# Altium schematic sheet drivers.SchDoc
size A4; SheetNumber: 1; SheetTotal: 1
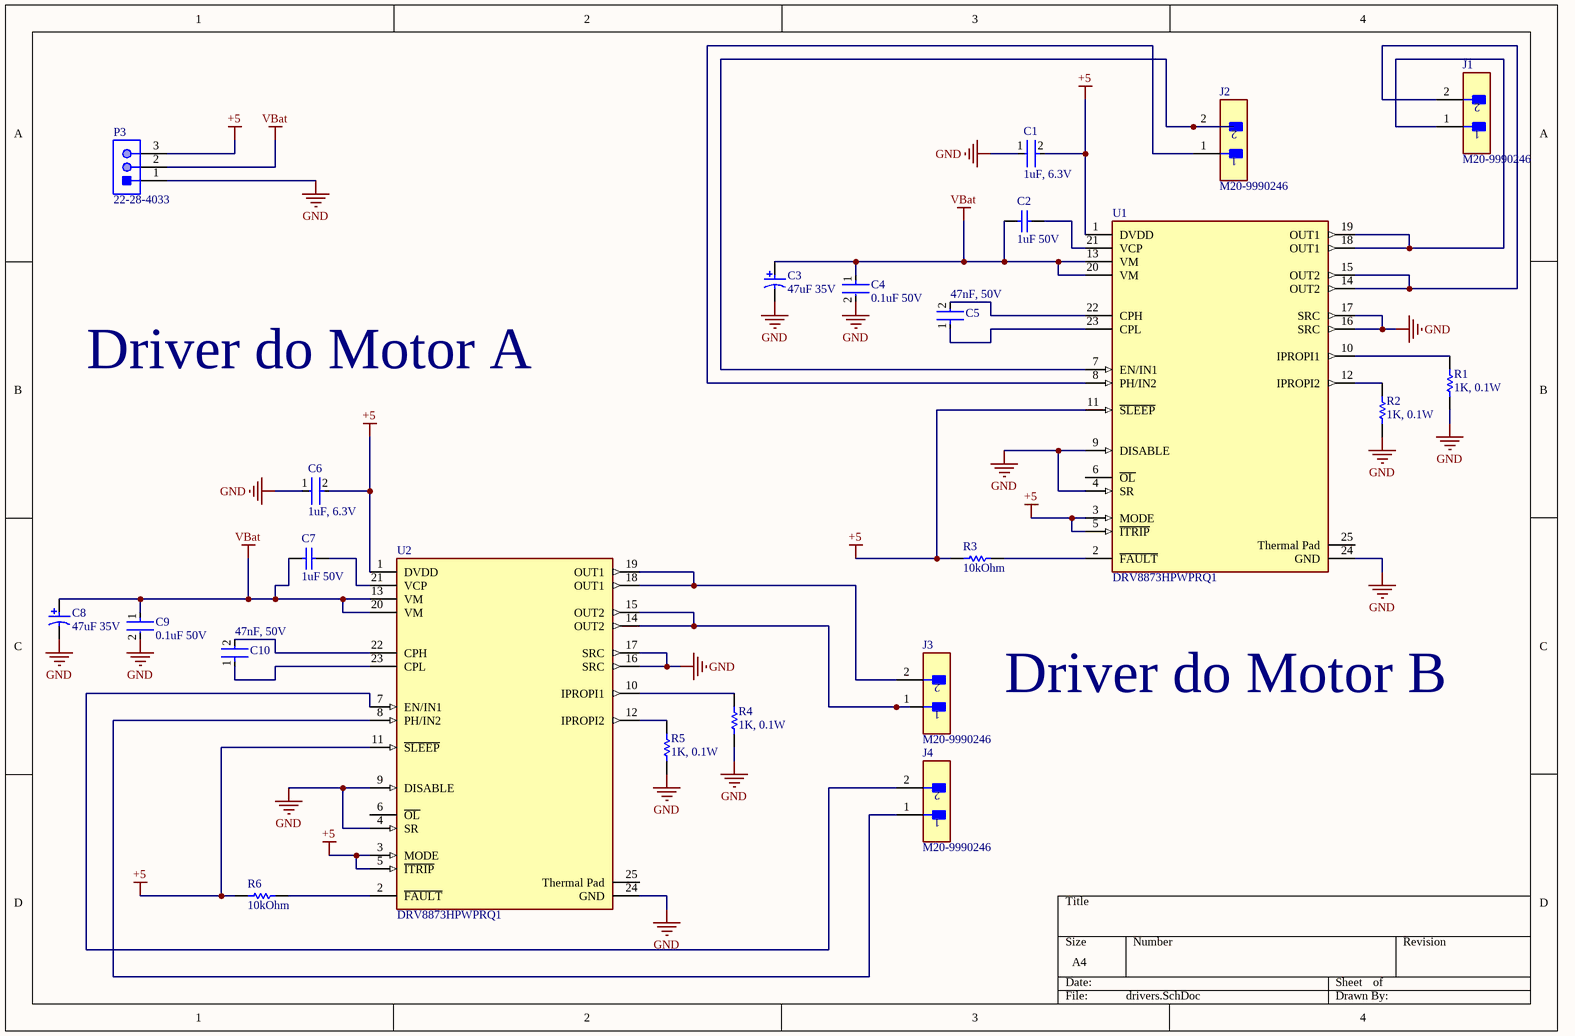
[diagram p0: drivers.SchDoc]

## Parts
C1  1uF, 6.3V  [FP-GRM188-0_1-MFG]
C2  1uF 50V  [CAPC1608X90X35ML10T25]
C3  47uF 35V  [PNSC-FP-V-D_V]
C4  0.1uF 50V  [FP-C0603-CJ-MFG]
C5  47nF, 50V  [FP-C0603C-CF-MFG]
C6  1uF, 6.3V  [FP-GRM188-0_1-MFG]
C7  1uF 50V  [CAPC1608X90X35ML10T25]
C8  47uF 35V  [PNSC-FP-V-D_V]
C9  0.1uF 50V  [FP-C0603-CJ-MFG]
C10  47nF, 50V  [FP-C0603C-CF-MFG]
J1  M20-9990246  [FP-M20-9990246-MFG]
J2  M20-9990246  [FP-M20-9990246-MFG]
J3  M20-9990246  [FP-M20-9990246-MFG]
J4  M20-9990246  [FP-M20-9990246-MFG]
P3  22-28-4033  [MOLX-22-28-4033_V]
R1  1K, 0.1W  [RESC1608X55X30LL20T20]
R2  1K, 0.1W  [RESC1608X55X30LL20T20]
R3  10kOhm  [RESC1609X55X30LL15T15]
R4  1K, 0.1W  [RESC1608X55X30LL20T20]
R5  1K, 0.1W  [RESC1608X55X30LL20T20]
R6  10kOhm  [RESC1609X55X30LL15T15]
U1  DRV8873HPWPRQ1  [FP-PWP0024J-MFG]
U2  DRV8873HPWPRQ1  [FP-PWP0024J-MFG]

## Nets
+5: C1.2 C6.2 P3.3 R3.1 R6.1 U1.1(DVDD) U1.3(MODE) U1.5(~{ITRIP}) U1.11(~{SLEEP}) U2.1(DVDD) U2.3(MODE) U2.5(~{ITRIP}) U2.11(~{SLEEP})
GND: C1.1 C3.2 C4.2 C6.1 C8.2 C9.2 P3.1 R1.1 R2.1 R4.1 R5.1 U1.4(SR) U1.9(DISABLE) U1.16(SRC) U1.17(SRC) U1.24(GND) U2.4(SR) U2.9(DISABLE) U2.16(SRC) U2.17(SRC) U2.24(GND)
VBat: C2.1 C3.1 C4.1 C7.1 C8.1 C9.1 P3.2 U1.13(VM) U1.20(VM) U2.13(VM) U2.20(VM)
NetC2_2: C2.2 U1.21(VCP)
NetC5_1: C5.1 U1.23(CPL)
NetC5_2: C5.2 U1.22(CPH)
NetC7_2: C7.2 U2.21(VCP)
NetC10_1: C10.1 U2.23(CPL)
NetC10_2: C10.2 U2.22(CPH)
NetJ1_1: J1.1 U1.18(OUT1) U1.19(OUT1)
NetJ1_2: J1.2 U1.14(OUT2) U1.15(OUT2)
NetJ2_1: J2.1 U1.8(PH/IN2)
NetJ2_2: J2.2 U1.7(EN/IN1)
NetJ3_1: J3.1 U2.14(OUT2) U2.15(OUT2)
NetJ3_2: J3.2 U2.18(OUT1) U2.19(OUT1)
NetJ4_1: J4.1 U2.8(PH/IN2)
NetJ4_2: J4.2 U2.7(EN/IN1)
NetR1_2: R1.2 U1.10(IPROPI1)
NetR2_2: R2.2 U1.12(IPROPI2)
NetR3_2: R3.2 U1.2(~{FAULT})
NetR4_2: R4.2 U2.10(IPROPI1)
NetR5_2: R5.2 U2.12(IPROPI2)
NetR6_2: R6.2 U2.2(~{FAULT})

Not connected (* = marked no-connect by the designer): U1 6(~{OL}) 25(Thermal_Pad); U2 6(~{OL}) 25(Thermal_Pad)

## Notes on the sheet
- Driver do Motor A
- Driver do Motor B

## Library data of the parts
C1 C6 = CMP-2006-02790-2: CAP CER 1UF 6.3V X5R 0603; Insulation Resistance: 500MR; Tolerance: 10%; Dielectric Material: Ceramic; Thickness: 0.035inch; Depth: 0.8mm; Min Operating Temperature: -55°C; Mount: Surface Mount; Voltage Rating (DC): 6.3V; Case/Package: 0603; Capacitance: 1uF; Voltage Rating: 6.3V; Voltage: 6.3V; Max Operating Temperature: 85°C; Case Code (Imperial): 0603; Dielectric: X5R; Packaging: Tape and Reel; Height: 0.8mm; Case Code (Metric): 1608; Radiation Hardening: No; REACH SVHC: No SVHC; Width: 0.031inch; Package Quantity: 1; Lead Free: Lead Free; Length: 1.6mm; Termination: SMD/SMT
C2 C7 = CMP-2000-05447-1: Chip Capacitor, 1 uF, +/- 10%, 50 V, -55 to 85 degC, 0603 (1608 Metric), RoHS, Tape and Reel; Manufacturer: Taiyo Yuden; Other Names: 587-2400-6; Temperature Coefficient: X5R; Online Catalog: MSeries; Catalog Drawings: xMKSeries_0603_0.8; Capacitance: 1µF; Series: M; Standard Package: 1; Package Description: 2-Pin Surface Mount Device, Body 1.6 x 0.8 mm; Ratings: -; Height - Seated (Max): -; Mounting Type: SurfaceMount,MLCC; Family: CeramicCapacitors; Size / Dimension: 0.063"Lx0.031"W(1.60mmx0.80mm); Features: -; Applications: GeneralPurpose; Lead Spacing: -; Packaging: Digi-Reel; Package Reference: 603; Thickness (Max): 0.035"(0.90mm); Category: Capacitors; Operating Temperature: -55degC~85degC; Datasheet URL: https://datasheet.ciiva.com/15922/336umk107bj105ka-t-15922611.pdf; Package / Case: 0603(1608Metric); Manufacturer URL: http://www.t-yuden.com/; Lead Style: -; Tolerance: ±10%; Voltage - Rated: 50V; Datasheet Version: Mar-13
C3 C8 = CMP-2000-06216-1: Aluminum Electrolytic Capacitor, 47 uF, +/- 20%, 35 V, 2-Pin SMD (Size Code D), -55 to 105 degC, RoHS, Tape and Reel; Manufacturer: Panasonic; Lifetime@Temperature: 2000Hrs@105°C; Capacitance: 47µF; Type: Can; Ripple Current: 300mA; ESR (Equivalent Series Resistance): 0.26O; Package Reference: FP-V-D; Package Description: 2-Pin Electrolytic Aluminum Capacitor, Body 6.6 x 6.6 mm; Datasheet URL: http://industrial.panasonic.com/cdbs/www-data/pdf/RDE0000/ABA0000C1184.pdf; Series: FP; Operating Temp Range: -55to+105°C; Operating Temp-Max: 105°C; Datasheet Version: 03/2016; Rated Voltage: 35V; Manufacturer URL: http://www.panasonic.com/; Package URL: http://industrial.panasonic.com/cdbs/www-data/pdf/RDE0000/DME0000COL48.pdf; Case Size/Dimension: Ø6.3x5.8mm; Mounting Technology: SurfaceMount
C4 C9 = CMP-2006-03300-2: CAP CER 0.1UF 50V X7R 0603; Manufacturer Part Number: C0603X104K5RACTU; Manufacturer: Kemet; Capacitance: 100nF; Material: Ceramic; Tolerance: 10%; Value: 100nF; Temperature Coefficient: 15%; Temperature Range High: +125°C; Temperature Range Low: -55°C; Voltage: 50V; ComponentLink2Description: Datasheet; RoHS: TRUE; ComponentLink2URL: https://content.kemet.com/datasheets/KEM_C1013_X7R_FT-CAP_SMD.pdf; Device Class L3: Ceramic Capacitors; Device Class L2: Capacitors; Package: C0603-CJ; Height: 0.95mm; Device Class L1: Passive Components; Temperature Characteristic: X7R; Lead Free: Yes; Digikey Description: CAP CER 0.1UF 50V X7R 0603; Automotive: No; Mouser Description: Capacitor; Ceramic; Cap 0.1uF; Tol+10%; SMT; Flexible Termination; Vol-Rtg 50V; TR; Temperature: -55°C to +125°C; Octopart: https://octopart.com/c0603x104k5ractu-kemet-9145062; Category: Cap; Voltage Rating: 50V; Ipc Land Pattern Name: CAPC16080X80
C5 C10 = CMP-2006-03232-2: CAP CER 0.047UF 50V 10% X7R 0603; Manufacturer: KEMET; Manufacturer Part Number: C0603C473K5RACTU; Value: 47,000 pF; Tolerance: 0.1; Temperature Coefficient: 30ppm/°C; Material: Ceramic; Automotive Grade: Grade 1; Lead Free: Yes; ComponentLink2URL: https://api.kemet.com/component-edge/download/datasheet/C0603C100J5GACAUTO.pdf; Temperature Characteristic: X7R; Category: Cap; Temperature Range High: +125°C; Automotive: Yes; Device Class L3: Ceramic Capacitors; Height: 0.87mm; Temperature: -55°C to +125°C; Mouser Description: Multilayer Ceramic Capacitors MLCC - SMD/SMT 50volts 47000pF X7R 10%; Package: C0603C-CF; Device Class L1: Passive Components; Digikey Description: CAP CER 0.047UF 50V 10% X7R 0603; Device Class L2: Capacitors; Voltage Rating: 50 V; Capacitance: 47,000 pF; ComponentLink2Description: Datasheet; RoHS: TRUE; Octopart: https://octopart.com/c0603c473k5ractu-kemet-9138594; Temperature Range Low: -55°C
J1-J4 = CMP-15831-000009-1: CONN HEADER VERT 2POS 2.54MM; Manufacturer: Harwin; Conn Gender: Male; Conn Orientation: Vertical; Number Of Contacts: 2; Current Rating: 3A; ComponentLink2URL: https://cdn.harwin.com/pdfs/M20-999.pdf; ComponentLink2Description: Datasheet; Package: M20-9990246; Temperature: -40°C to +105°C; Octopart: https://octopart.com/m20-9990246-harwin-2590635; Mouser Description: 2.54mm (0.1") Pitch SIL Vertical PC Tail Pin Header, 6.1mm mating pin height, tin, 2 contacts; Temperature Range High: +105°C; Device Class L1: Connectors; RoHS: TRUE; Automotive: No; Height: 8.99mm; Number Of Rows: 1; Contact Material: Tin,Nickel; Category: Conn; Pitch: 2.54mm; Lead Free: Yes; Digikey Description: CONN HEADER VERT 2POS 2.54MM; Manufacturer Part Number: M20-9990246; Temperature Range Low: -40°C; Device Class L3: unset; Device Class L2: Headers and Wire Housings
P3 = CMP-1676-00001-5: Male Header, Pitch 2.54 mm, 1 x 3 Position, Height 8.38 mm, Tail Length 3.18 mm, RoHS, Bulk; Manufacturer: Molex; Rows: 1; Voltage Rating: 250 V; Current Rating: 4 A; Min Operating Temperature: 0 degC; Lead Pitch: 0.1 inch; Packaging: Bulk; Contact Finish: Gold; RoHSCompliant: true; Contact Material: Brass; PackageReference: 22-28-4033; REACH SVHC: Unknown; PackageDescription: Male Header, Pitch 2.54 mm, 1 x 3 Position, Height 8.38 mm, Tail Length 3.18 mm; ComponentLink2URL: http://www.molex.com/pdm_docs/sd/022284033_sd.pdf; Height: 8.38 mm; Mounting Technology: Through Hole; ComponentLink1Description: Manufacturer URL; Length: 7.62 mm; Mount: Through Hole; DatasheetVersion: Rev. G, 01/2012; Max Operating Temperature: 75 degC; ComponentLink2Description: Datasheet; Colour: Black; Pins: 3; Contact Plating: Gold; Package Quantity: 1; ComponentLink1URL: http://www.molex.com/
R1 R2 R4 R5 = CMP-2000-00873-1: Manufacturer: Panasonic; Part Number: ERA3AEB102V
R3 R6 = CMP-1012-00623-3: Chip Resistor, 10 KOhm, +/- 1%, 0.1 W, -55 to 155 degC, 0603 (1608 Metric), RoHS, Tape and Reel; Manufacturer: Panasonic; Voltage Rating: 75V; Case\/Package: 0603; Power Rating: 100mW; Temperature Coefficient: 100ppm\/degreesC; Number of Pins: 2; Package Reference: 603; Depth: 0.8mm; Mount: SurfaceMount; Package Description: 2-Pin Surface Mount Device, Body 1.6 x 0.85 mm; Datasheet Version: 02/2017; Resistance: 10KOhm; Length: 1.6mm; Lead Free: LeadFree; Height: 0.45mm; Number of Terminations: 2; Max Power Dissipation: 100mW; Min Operating Temperature: -55degC; Datasheet URL: https://industrial.panasonic.com/cdbs/www-data/pdf/RDA0000/AOA0000C304.pdf; Termination: SMD/SMT; Case Code (Metric): 1608; Case Code (Imperial): 0603; Tolerance: 1%; Max Operating Temperature: 155degC; RoHSCompliant: true; Voltage Rating (DC): 75V; Radiation Hardening: No; Packaging: TapeandReel; Composition: ThickFilm; Mounting Technology: SurfaceMount; Manufacturer URL: http://www.panasonic.com/; Width: 0.031inch; REACH SVHC: NoSVHC; Contact Plating: Tin; Military Standard: Not; Package Quantity: 1
U1 U2 = CMP-04915-000006-1: IC MTRDRV UNIPLR 0-5.5V 24HTSSOP; Manufacturer: Texas Instruments; Max Supply Voltage: 38V; Number Of Outputs: 2; Standoff Height: 0.05mm; Max Junction Temp: +150°C; Switching Frequency: 400kHz; Nominal Supply Current: 5mA; Automotive Grade: Grade 1; Min Supply Voltage: 4.5V; Motor Type: Brushed; Output Current: 10A; Automotive: Yes; Device Class L2: Power Management ICs; Category: IC; Package: PWP0024J; Temperature Range Low: -40°C; Device Class L1: Integrated Circuits (ICs); Temperature: -40°C to +125°C; Octopart: https://octopart.com/drv8873hpwprq1-texas+instruments-94502234; Ipc Land Pattern Name: SOP65P640X120-24; Ambient Temperature Range High: +125°C; Temperature Range High: +125°C; Height: 1.2mm; Device Class L3: Motor Drivers; Lead Free: Yes; ComponentLink2URL: http://www.ti.com/lit/ds/symlink/drv8873-q1.pdf; Manufacturer Part Number: DRV8873HPWPRQ1; Digikey Description: IC MTRDRV UNIPLR 0-5.5V 24HTSSOP; Ambient Temperature Range Low: -40°C; ComponentLink2Description: Datasheet; RoHS: TRUE; Mouser Description: Automotive H-Bridge Motor Driver 24-HTSSOP -40 to 125